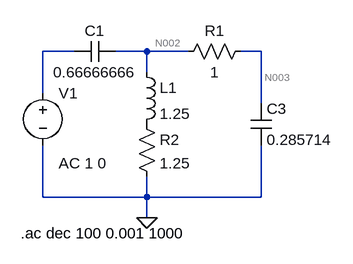
[diagram p0: schematic EJ2.asc]
EJ2.asc, the LTspice schematic file:
Version 4
SHEET 1 880 680
WIRE -16 32 -64 32
WIRE 96 32 48 32
WIRE 160 32 96 32
WIRE 272 32 240 32
WIRE 96 64 96 32
WIRE -64 96 -64 32
WIRE 272 112 272 32
WIRE -64 256 -64 176
WIRE 96 256 96 224
WIRE 96 256 -64 256
WIRE 272 256 272 176
WIRE 272 256 96 256
WIRE 96 288 96 256
FLAG 96 288 0
SYMBOL cap 48 16 R90
WINDOW 0 0 32 VBottom 2
WINDOW 3 32 32 VTop 2
SYMATTR InstName C1
SYMATTR Value 0.66666666
SYMBOL res 256 16 R90
WINDOW 0 0 56 VBottom 2
WINDOW 3 32 56 VTop 2
SYMATTR InstName R1
SYMATTR Value 1
SYMBOL res 80 128 R0
SYMATTR InstName R2
SYMATTR Value 1.25
SYMBOL cap 256 112 R0
SYMATTR InstName C3
SYMATTR Value 0.285714
SYMBOL voltage -64 80 R0
WINDOW 123 24 124 Left 2
WINDOW 39 0 0 Left 0
SYMATTR InstName V1
SYMATTR Value ""
SYMATTR Value2 AC 1 0
SYMBOL ind 80 48 R0
SYMATTR InstName L1
SYMATTR Value 1.25
TEXT -98 312 Left 2 !.ac dec 100 0.001 1000

The netlist it stands for:
* EJ2.asc
C1 N002 N001 0.66666666
R1 N003 N002 1
R2 P001 0 1.25
C3 N003 0 0.285714
V1 N001 0 AC 1 0
L1 N002 P001 1.25
.ac dec 100 0.001 1000
.backanno
.end

* Results of the author's LTspice run, read from the files saved beside the schematic
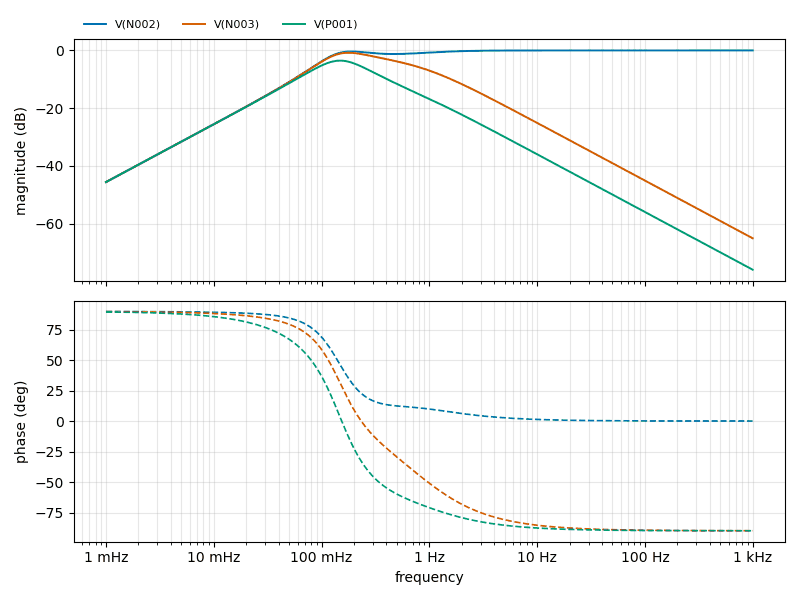
[diagram p1: AC Analysis of EJ2.asc, plotted from the saved traces]
* AC Analysis, 1 run:
*   V(N002): -45.61 dB at 1 mHz, -0.00 dB at 1 kHz, peak -0.00 dB at 1 kHz, 3 dB below the peak at 108.4 mHz
*   V(N003): -45.61 dB at 1 mHz, -65.08 dB at 1 kHz, peak -0.81 dB at 177.8 mHz, 3 dB below the peak at 101.1 mHz and 501.7 mHz
*   V(P001): -45.62 dB at 1 mHz, -75.96 dB at 1 kHz, peak -3.54 dB at 147.9 mHz, 3 dB below the peak at 85.06 mHz and 265.7 mHz